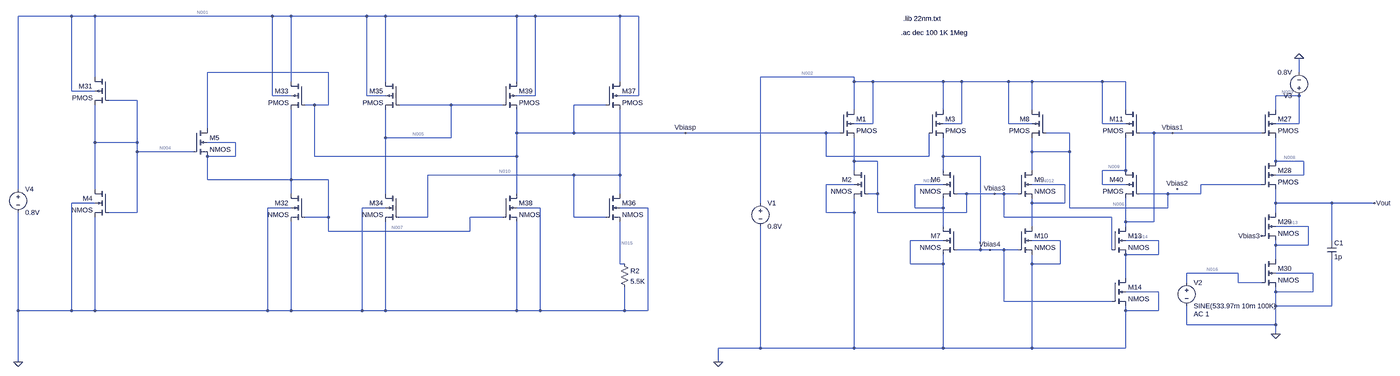
[diagram p0: schematic ckt22nm.asc, whole sheet]
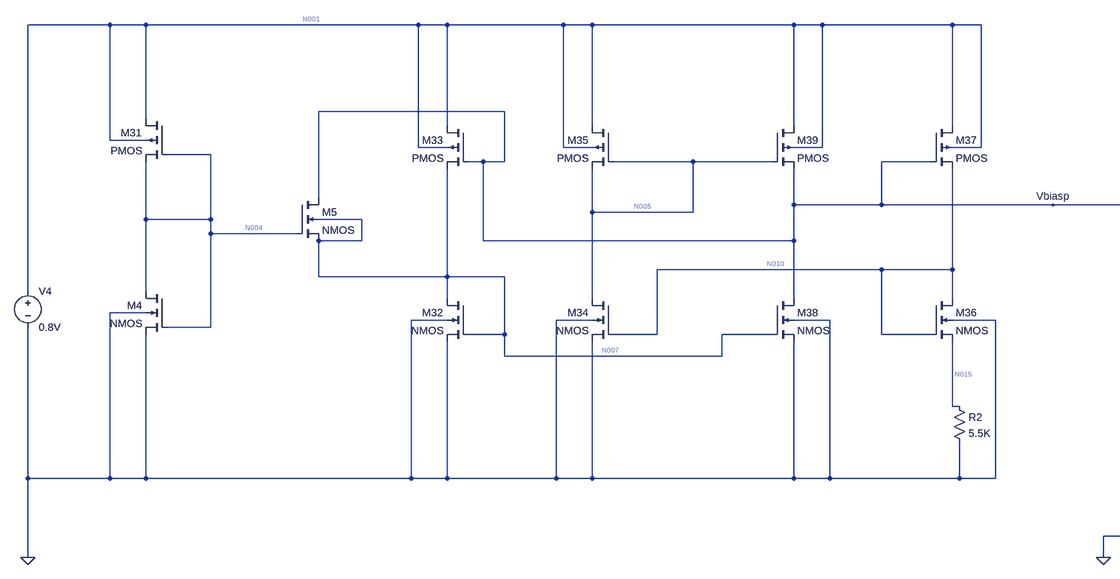
[diagram p1: schematic ckt22nm.asc, part, row 1 of 1, column 1 of 2]
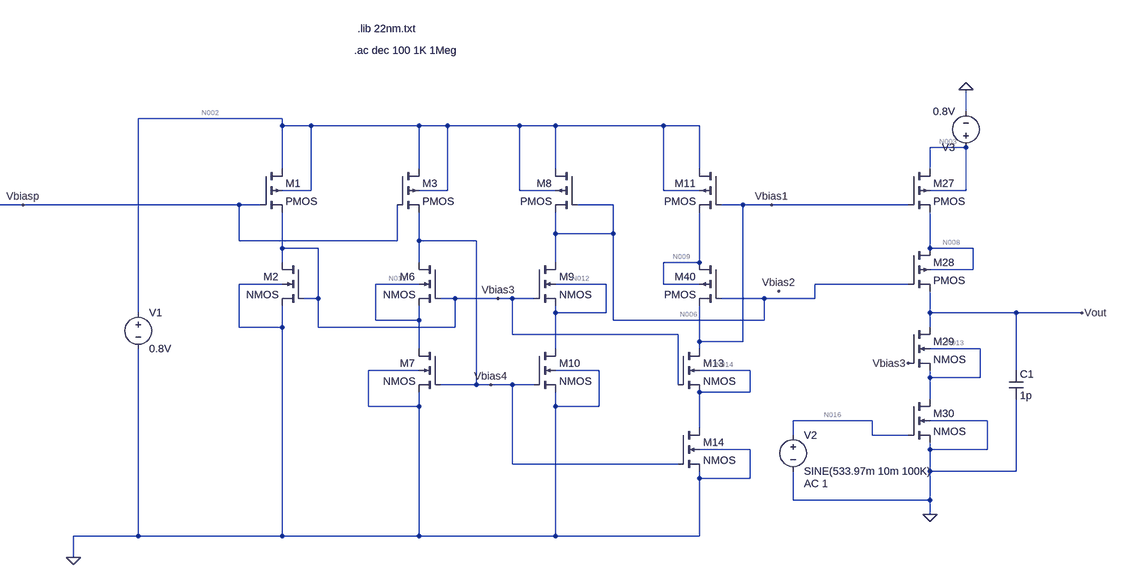
[diagram p2: schematic ckt22nm.asc, part, row 1 of 1, column 2 of 2]
ckt22nm.asc, the LTspice schematic file:
Version 4
SHEET 1 6792 2132
WIRE 224 -832 -240 -832
WIRE 304 -832 224 -832
WIRE 1040 -832 304 -832
WIRE 1104 -832 1040 -832
WIRE 1376 -832 1104 -832
WIRE 1440 -832 1376 -832
WIRE 1888 -832 1440 -832
WIRE 1952 -832 1888 -832
WIRE 2304 -832 1952 -832
WIRE 2368 -832 2304 -832
WIRE 1232 -640 688 -640
WIRE 4624 -640 4624 -688
WIRE 304 -624 304 -832
WIRE 3104 -624 2784 -624
WIRE 1104 -608 1104 -832
WIRE 1440 -608 1440 -832
WIRE 1888 -608 1888 -832
WIRE 2304 -608 2304 -832
WIRE 3104 -608 3104 -624
WIRE 3168 -608 3104 -608
WIRE 3408 -608 3168 -608
WIRE 3472 -608 3408 -608
WIRE 3632 -608 3472 -608
WIRE 3712 -608 3632 -608
WIRE 3952 -608 3712 -608
WIRE 4032 -608 3952 -608
WIRE 224 -576 224 -832
WIRE 304 -576 224 -576
WIRE 1040 -560 1040 -832
WIRE 1104 -560 1040 -560
WIRE 1376 -560 1376 -832
WIRE 1440 -560 1376 -560
WIRE 1952 -560 1952 -832
WIRE 1952 -560 1888 -560
WIRE 2368 -560 2368 -832
WIRE 2368 -560 2304 -560
WIRE 4624 -560 4544 -560
WIRE 448 -544 352 -544
WIRE 1184 -528 1152 -528
WIRE 1232 -528 1232 -640
WIRE 1232 -528 1184 -528
WIRE 1664 -528 1488 -528
WIRE 1840 -528 1664 -528
WIRE 2256 -528 2112 -528
WIRE 3104 -512 3104 -608
WIRE 3408 -512 3408 -608
WIRE 3712 -512 3712 -608
WIRE 4032 -512 4032 -608
WIRE 4544 -512 4544 -560
WIRE 3168 -464 3168 -608
WIRE 3168 -464 3104 -464
WIRE 3472 -464 3472 -608
WIRE 3472 -464 3408 -464
WIRE 3632 -464 3632 -608
WIRE 3712 -464 3632 -464
WIRE 3952 -464 3952 -608
WIRE 4032 -464 3952 -464
WIRE 4624 -464 4624 -560
WIRE 4624 -464 4544 -464
WIRE 688 -448 688 -640
WIRE 1888 -432 1888 -512
WIRE 2112 -432 2112 -528
WIRE 2112 -432 1888 -432
WIRE 2528 -432 2112 -432
WIRE 3008 -432 2528 -432
WIRE 3056 -432 3008 -432
WIRE 3840 -432 3760 -432
WIRE 4128 -432 4080 -432
WIRE 4192 -432 4128 -432
WIRE 4496 -432 4192 -432
WIRE 1440 -416 1440 -512
WIRE 1664 -416 1664 -528
WIRE 1664 -416 1440 -416
WIRE 304 -400 304 -528
WIRE 448 -400 448 -544
WIRE 448 -400 304 -400
WIRE 784 -400 688 -400
WIRE 448 -368 448 -400
WIRE 640 -368 448 -368
WIRE 3712 -368 3712 -416
WIRE 3840 -368 3840 -432
WIRE 3840 -368 3712 -368
WIRE 784 -352 784 -400
WIRE 784 -352 688 -352
WIRE 1184 -352 1184 -528
WIRE 1888 -352 1888 -432
WIRE 1888 -352 1184 -352
WIRE 3008 -352 3008 -432
WIRE 3360 -352 3360 -432
WIRE 3360 -352 3008 -352
WIRE 3408 -352 3408 -416
WIRE 3536 -352 3408 -352
WIRE 3104 -336 3104 -416
WIRE 3184 -336 3104 -336
WIRE 4544 -336 4544 -416
WIRE 4640 -336 4544 -336
WIRE 3104 -304 3104 -336
WIRE 3408 -304 3408 -352
WIRE 3712 -304 3712 -368
WIRE 4032 -304 4032 -416
WIRE 4032 -304 3952 -304
WIRE 2112 -288 1584 -288
WIRE 2304 -288 2304 -512
WIRE 2304 -288 2112 -288
WIRE 4640 -288 4640 -336
WIRE 4640 -288 4544 -288
WIRE 688 -272 688 -352
WIRE 1104 -272 1104 -512
WIRE 1104 -272 688 -272
WIRE 1232 -272 1104 -272
WIRE 3104 -256 3008 -256
WIRE 3408 -256 3312 -256
WIRE 3824 -256 3712 -256
WIRE 3952 -256 3952 -304
WIRE 4032 -256 3952 -256
WIRE 4496 -256 4288 -256
WIRE -240 -240 -240 -832
WIRE 304 -240 304 -400
WIRE 1104 -224 1104 -272
WIRE 1440 -224 1440 -416
WIRE 1888 -224 1888 -352
WIRE 2304 -224 2304 -288
WIRE 3184 -224 3184 -336
WIRE 3184 -224 3152 -224
WIRE 3488 -224 3456 -224
WIRE 3584 -224 3488 -224
WIRE 3616 -224 3584 -224
WIRE 3664 -224 3616 -224
WIRE 4176 -224 4080 -224
WIRE 4288 -224 4288 -256
WIRE 4288 -224 4176 -224
WIRE 304 -192 224 -192
WIRE 2784 -192 2784 -624
WIRE 3712 -192 3712 -208
WIRE 3824 -192 3824 -256
WIRE 3824 -192 3712 -192
WIRE 4544 -192 4544 -240
WIRE 4736 -192 4544 -192
WIRE 5120 -192 4736 -192
WIRE 1104 -176 1024 -176
WIRE 1440 -176 1360 -176
WIRE 1968 -176 1888 -176
WIRE 2400 -176 2304 -176
WIRE 3312 -176 3312 -256
WIRE 3408 -176 3408 -208
WIRE 3408 -176 3312 -176
WIRE 3840 -176 3840 -368
WIRE 4176 -176 4176 -224
WIRE 4176 -176 3840 -176
WIRE 448 -160 448 -368
WIRE 448 -160 352 -160
WIRE 3008 -160 3008 -256
WIRE 3104 -160 3104 -208
WIRE 3104 -160 3008 -160
WIRE 3184 -160 3184 -224
WIRE 3488 -160 3488 -224
WIRE 3488 -160 3184 -160
WIRE 4544 -160 4544 -192
WIRE 1232 -144 1232 -272
WIRE 1232 -144 1152 -144
WIRE 1584 -144 1584 -288
WIRE 1584 -144 1488 -144
WIRE 1840 -144 1728 -144
WIRE 2112 -144 2112 -288
WIRE 2256 -144 2112 -144
WIRE 3616 -144 3616 -224
WIRE 3984 -144 3616 -144
WIRE 4032 -128 4032 -208
WIRE 4128 -128 4128 -432
WIRE 4128 -128 4032 -128
WIRE 3408 -112 3408 -176
WIRE 3712 -112 3712 -192
WIRE 4032 -112 4032 -128
WIRE 4656 -112 4544 -112
WIRE 1232 -96 1232 -144
WIRE 1728 -96 1728 -144
WIRE 1728 -96 1232 -96
WIRE 3408 -64 3296 -64
WIRE 3808 -64 3712 -64
WIRE 4144 -64 4032 -64
WIRE 4736 -64 4736 -192
WIRE 4544 -48 4544 -64
WIRE 4656 -48 4656 -112
WIRE 4656 -48 4544 -48
WIRE 3536 -32 3536 -352
WIRE 3536 -32 3456 -32
WIRE 3568 -32 3536 -32
WIRE 3616 -32 3568 -32
WIRE 3664 -32 3616 -32
WIRE 3984 -32 3984 -144
WIRE 4144 -16 4144 -64
WIRE 4144 -16 4032 -16
WIRE 4544 0 4544 -48
WIRE 2304 16 2304 -128
WIRE 2320 16 2304 16
WIRE 3296 16 3296 -64
WIRE 3408 16 3408 -16
WIRE 3408 16 3296 16
WIRE 3712 16 3712 -16
WIRE 3808 16 3808 -64
WIRE 3808 16 3712 16
WIRE 4416 48 4240 48
WIRE 4672 48 4544 48
WIRE 4032 64 4032 -16
WIRE 4240 80 4240 48
WIRE 4416 80 4416 48
WIRE 4496 80 4416 80
WIRE 4144 112 4032 112
WIRE 4544 112 4544 96
WIRE 4672 112 4672 48
WIRE 4672 112 4544 112
WIRE 3616 144 3616 -32
WIRE 3984 144 3616 144
WIRE 4544 160 4544 112
WIRE 4736 160 4736 0
WIRE 4736 160 4544 160
WIRE -240 176 -240 -160
WIRE 224 176 224 -192
WIRE 224 176 -240 176
WIRE 304 176 304 -144
WIRE 304 176 224 176
WIRE 1024 176 1024 -176
WIRE 1024 176 304 176
WIRE 1104 176 1104 -128
WIRE 1104 176 1024 176
WIRE 1360 176 1360 -176
WIRE 1360 176 1104 176
WIRE 1440 176 1440 -128
WIRE 1440 176 1360 176
WIRE 1888 176 1888 -128
WIRE 1888 176 1440 176
WIRE 1968 176 1968 -176
WIRE 1968 176 1888 176
WIRE 2320 176 2320 96
WIRE 2320 176 1968 176
WIRE 2400 176 2400 -176
WIRE 2400 176 2320 176
WIRE 4032 176 4032 160
WIRE 4144 176 4144 112
WIRE 4144 176 4032 176
WIRE 4240 224 4240 160
WIRE 4544 224 4544 160
WIRE 4544 224 4240 224
WIRE 4544 256 4544 224
WIRE 2784 304 2784 -112
WIRE 2784 304 2640 304
WIRE 3104 304 3104 -160
WIRE 3104 304 2784 304
WIRE 3408 304 3408 16
WIRE 3408 304 3104 304
WIRE 3712 304 3712 16
WIRE 3712 304 3408 304
WIRE 4032 304 4032 176
WIRE 4032 304 3712 304
WIRE -240 352 -240 176
WIRE 2640 352 2640 304
FLAG 4624 -688 0
FLAG 4544 256 0
FLAG 4496 -80 Vbias3
FLAG 2640 352 0
FLAG 3584 -224 Vbias3
FLAG 3568 -32 Vbias4
FLAG 5120 -192 Vout
FLAG 4192 -432 Vbias1
FLAG 4208 -240 Vbias2
FLAG 2528 -432 Vbiasp
FLAG -240 352 0
SYMBOL pmos4 4496 -512 R0
SYMATTR InstName M27
SYMATTR Value2 l=50n w=650n
SYMBOL pmos4 4496 -336 R0
SYMATTR InstName M28
SYMATTR Value2 l=50n w=650n
SYMBOL nmos4 4496 -160 R0
SYMATTR InstName M29
SYMATTR Value2 l=50n w=350n
SYMBOL nmos4 4496 0 R0
SYMATTR InstName M30
SYMATTR Value2 l=50n w=350n
SYMBOL voltage 4624 -544 R180
WINDOW 123 0 0 Left 0
WINDOW 39 0 0 Left 0
SYMATTR InstName V3
SYMATTR Value 0.8V
SYMBOL cap 4720 -64 R0
SYMATTR InstName C1
SYMATTR Value 1p
SYMBOL voltage -240 -256 R0
WINDOW 123 0 0 Left 0
WINDOW 39 0 0 Left 0
SYMATTR InstName V4
SYMATTR Value 0.8V
SYMBOL nmos4 352 -240 M0
SYMATTR InstName M4
SYMATTR Value2 l=44n w=220n
SYMBOL nmos4 640 -448 R0
SYMATTR InstName M5
SYMATTR Value2 l=44n w=88n
SYMBOL pmos4 352 -624 M0
SYMATTR InstName M31
SYMATTR Value2 l=440n w=220n
SYMBOL nmos4 1152 -224 M0
SYMATTR InstName M32
SYMATTR Value2 l=44n w=220n
SYMBOL pmos4 1152 -608 M0
SYMATTR InstName M33
SYMATTR Value2 l=44n w=528n
SYMBOL nmos4 1488 -224 M0
SYMATTR InstName M34
SYMATTR Value2 l=44n w=220n
SYMBOL pmos4 1488 -608 M0
SYMATTR InstName M35
SYMATTR Value2 l=44n w=528n
SYMBOL nmos4 2256 -224 R0
SYMATTR InstName M36
SYMATTR Value2 l=44n w=660n
SYMBOL pmos4 2256 -608 R0
SYMATTR InstName M37
SYMATTR Value2 l=44n w=528n
SYMBOL nmos4 1840 -224 R0
SYMATTR InstName M38
SYMATTR Value2 l=44n w=220n
SYMBOL pmos4 1840 -608 R0
SYMATTR InstName M39
SYMATTR Value2 l=44n w=528n
SYMBOL res 2304 0 R0
SYMATTR InstName R2
SYMATTR Value 5.5K
SYMBOL pmos4 3056 -512 R0
SYMATTR InstName M1
SYMATTR Value2 l=44n w=528n
SYMBOL nmos4 3152 -304 M0
SYMATTR InstName M2
SYMATTR Value2 l=44n w=110n
SYMBOL pmos4 3360 -512 R0
SYMATTR InstName M3
SYMATTR Value2 l=44n w=528n
SYMBOL nmos4 3456 -304 M0
SYMATTR InstName M6
SYMATTR Value2 l=44n w=220n
SYMBOL nmos4 3456 -112 M0
SYMATTR InstName M7
SYMATTR Value2 l=44n w=220n
SYMBOL pmos4 3760 -512 M0
SYMATTR InstName M8
SYMATTR Value2 l=110n w=440n
SYMBOL nmos4 3664 -304 R0
SYMATTR InstName M9
SYMATTR Value2 l=44n w=220n
SYMBOL nmos4 3664 -112 R0
SYMATTR InstName M10
SYMATTR Value2 l=44n w=220n
SYMBOL pmos4 4080 -512 M0
SYMATTR InstName M11
SYMATTR Value2 l=44n w=528n
SYMBOL nmos4 3984 -112 R0
SYMATTR InstName M13
SYMATTR Value2 l=44n w=220n
SYMBOL nmos4 3984 64 R0
SYMATTR InstName M14
SYMATTR Value2 l=44n w=220n
SYMBOL voltage 2784 -208 R0
WINDOW 123 0 0 Left 0
WINDOW 39 0 0 Left 0
SYMATTR InstName V1
SYMATTR Value 0.8V
SYMBOL pmos4 4080 -304 M0
SYMATTR InstName M40
SYMATTR Value2 l=44n w=528n
SYMBOL voltage 4240 64 R0
WINDOW 123 24 124 Left 2
WINDOW 39 0 0 Left 0
SYMATTR Value2 AC 1
SYMATTR InstName V2
SYMATTR Value SINE(533.97m 10m 100K)
TEXT 3272 -824 Left 2 !.lib 22nm.txt
TEXT 3264 -776 Left 2 !.ac dec 100 1K 1Meg

The netlist it stands for:
* ckt22nm.asc
M27 N003 Vbias1 N008 N003 PMOS l=50n w=650n
M28 N008 N006 Vout N008 PMOS l=50n w=650n
M29 Vout Vbias3 N013 N013 NMOS l=50n w=350n
M30 N013 N016 0 0 NMOS l=50n w=350n
V3 N003 0 0.8V
C1 Vout 0 1p
V4 N001 0 0.8V
M4 N004 N004 0 0 NMOS l=44n w=220n
M5 Vbiasp N004 N007 N007 NMOS l=44n w=88n
M31 N001 N004 N004 N001 PMOS l=440n w=220n
M32 N007 N007 0 0 NMOS l=44n w=220n
M33 N001 Vbiasp N007 N001 PMOS l=44n w=528n
M34 N005 N010 0 0 NMOS l=44n w=220n
M35 N001 N005 N005 N001 PMOS l=44n w=528n
M36 N010 N010 N015 0 NMOS l=44n w=660n
M37 N001 Vbiasp N010 N001 PMOS l=44n w=528n
M38 Vbiasp N007 0 0 NMOS l=44n w=220n
M39 N001 N005 Vbiasp N001 PMOS l=44n w=528n
R2 N015 0 5.5K
M1 N002 Vbiasp Vbias3 N002 PMOS l=44n w=528n
M2 Vbias3 Vbias3 0 0 NMOS l=44n w=110n
M3 N002 Vbiasp Vbias4 N002 PMOS l=44n w=528n
M6 Vbias4 Vbias3 N011 N011 NMOS l=44n w=220n
M7 N011 Vbias4 0 0 NMOS l=44n w=220n
M8 N002 N006 N006 N002 PMOS l=110n w=440n
M9 N006 Vbias3 N012 N012 NMOS l=44n w=220n
M10 N012 Vbias4 0 0 NMOS l=44n w=220n
M11 N002 Vbias1 N009 N002 PMOS l=44n w=528n
M13 Vbias1 Vbias3 N014 N014 NMOS l=44n w=220n
M14 N014 Vbias4 0 0 NMOS l=44n w=220n
V1 N002 0 0.8V
M40 N009 N006 Vbias1 N009 PMOS l=44n w=528n
V2 N016 0 SINE(533.97m 10m 100K) AC 1
.model NMOS NMOS
.model PMOS PMOS
.lib standard.mos
.lib 22nm.txt
.ac dec 100 1K 1Meg
.backanno
.end

* Results of the author's LTspice run, read from the files saved beside the schematic
* Operating Point, zero values left out:
*   V(n003) = 800 mV
*   V(vbias1) = 244.3 mV
*   V(n008) = 690.4 mV
*   V(n006) = 138.1 mV
*   V(vout) = 567 mV
*   V(vbias3) = 591.8 mV
*   V(n013) = 74.41 mV
*   V(n016) = 534 mV
*   V(n001) = 800 mV
*   V(n004) = 312.1 mV
*   V(vbiasp) = 248.5 mV
*   V(n007) = 539.9 mV
*   V(n005) = 265.7 mV
*   V(n010) = 538.9 mV
*   V(n015) = 52.69 mV
*   V(n002) = 800 mV
*   V(vbias4) = 584.5 mV
*   V(n011) = 53.52 mV
*   V(n012) = 44.94 mV
*   V(n009) = 677.3 mV
*   V(n014) = 49.05 mV
*   Id(M27) = 8.609 µA
*   Is(M27) = -8.609 µA
*   Id(M28) = 8.609 µA
*   Is(M28) = -8.609 µA
*   Id(M31) = 87.46 nA
*   Is(M31) = -87.46 nA
*   Id(M33) = 9.575 µA
*   Is(M33) = -9.575 µA
*   Id(M35) = 8.513 µA
*   Is(M35) = -8.513 µA
*   Id(M37) = 9.58 µA
*   Is(M37) = -9.58 µA
*   Id(M39) = 8.58 µA
*   Is(M39) = -8.58 µA
*   Id(M1) = 9.28 µA
*   Is(M1) = -9.28 µA
*   Id(M3) = 9.326 µA
*   Is(M3) = -9.326 µA
*   Id(M8) = 8.186 µA
*   Ig(M8) = -2.776 pA
*   Ib(M8) = 3.429 pA
*   Is(M8) = -8.186 µA
*   Id(M11) = 8.749 µA
*   Is(M11) = -8.749 µA
*   Id(M40) = 8.749 µA
*   Is(M40) = -8.749 µA
*   Id(M29) = 8.609 µA
*   Ig(M29) = 16.6 pA
*   Is(M29) = -8.609 µA
*   Id(M30) = 8.609 µA
*   Ig(M30) = 26.95 pA
*   Is(M30) = -8.609 µA
*   Id(M4) = 87.46 nA
*   Is(M4) = -87.46 nA
*   Id(M5) = -1.374 nA
*   Ib(M5) = 780.8 pA
*   Is(M5) = 594.1 pA
*   Id(M32) = 9.574 µA
*   Ig(M32) = 13.66 pA
*   Is(M32) = -9.574 µA
*   Id(M34) = 8.513 µA
*   Ig(M34) = 13.83 pA
*   Is(M34) = -8.513 µA
*   Id(M36) = 9.58 µA
*   Ig(M36) = 16.32 pA
*   Is(M36) = -9.58 µA
*   Id(M38) = 8.582 µA
*   Ig(M38) = 14.17 pA
*   Is(M38) = -8.582 µA
*   Id(M2) = 9.28 µA
*   Ig(M2) = 13.69 pA
*   Is(M2) = -9.28 µA
*   Id(M6) = 9.326 µA
*   Ig(M6) = 13.33 pA
*   Is(M6) = -9.326 µA
*   Id(M7) = 9.326 µA
*   Ig(M7) = 31.15 pA
*   Is(M7) = -9.326 µA
*   Id(M9) = 8.186 µA
*   Ig(M9) = 17.96 pA
*   Is(M9) = -8.186 µA
*   Id(M10) = 8.186 µA
*   Ig(M10) = 31.48 pA
*   Is(M10) = -8.186 µA
*   Id(M13) = 8.749 µA
*   Ig(M13) = 15.33 pA
*   Is(M13) = -8.749 µA
*   Id(M14) = 8.749 µA
*   Ig(M14) = 31.32 pA
*   Is(M14) = -8.749 µA
*   I(R2) = 9.58 µA
*   I(V3) = -8.609 µA
*   I(V4) = -36.34 µA
*   I(V1) = -35.54 µA
*   I(V2) = -26.95 pA
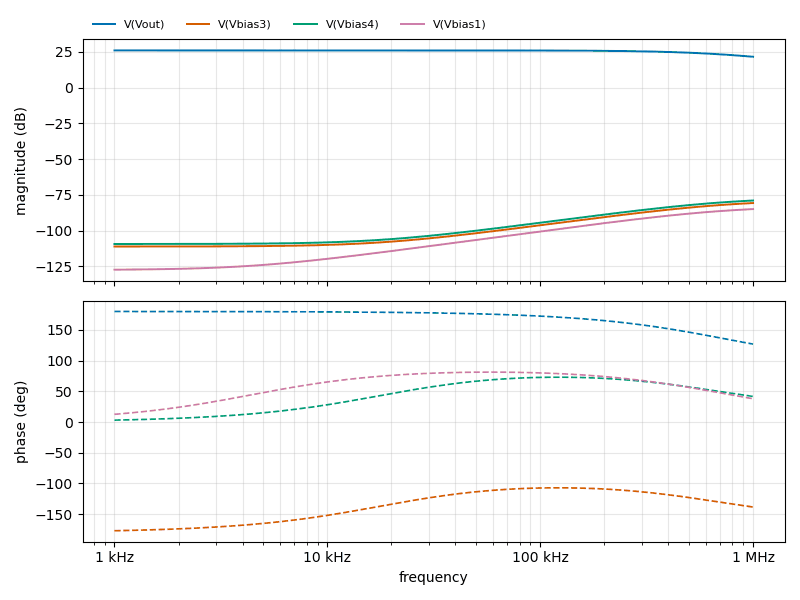
[diagram p3: AC Analysis of ckt22nm.asc, plotted from the saved traces]
* AC Analysis, 1 run:
*   V(Vout): 25.99 dB at 1 kHz, 21.54 dB at 1 MHz, peak 25.99 dB at 1 kHz, 3 dB below the peak at 748 kHz
*   V(Vbias3): -111.07 dB at 1 kHz, -80.68 dB at 1 MHz, peak -80.68 dB at 1 MHz, 3 dB below the peak at 516.5 kHz
*   V(Vbias4): -109.31 dB at 1 kHz, -78.92 dB at 1 MHz, peak -78.92 dB at 1 MHz, 3 dB below the peak at 516.5 kHz
*   V(Vbias1): -127.26 dB at 1 kHz, -84.91 dB at 1 MHz, peak -84.91 dB at 1 MHz, 3 dB below the peak at 514 kHz